# Altium project 4Z_PCB_2.PrjPcb
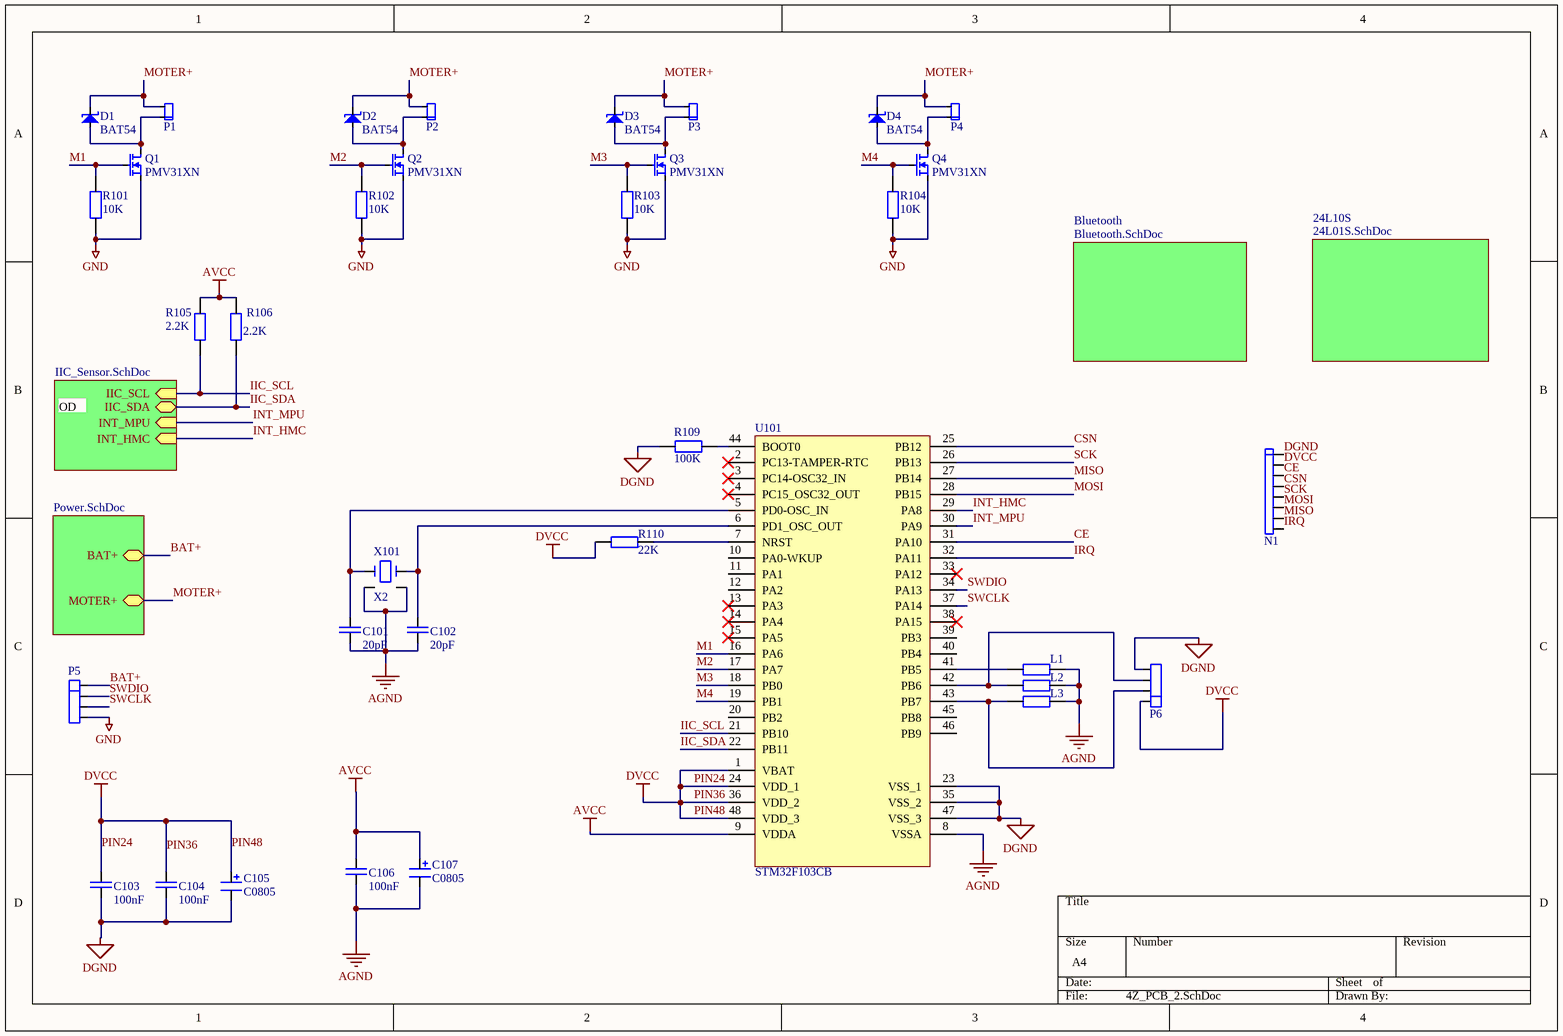
[diagram p0: 4Z_PCB_2.SchDoc]
3 sheets, 54 parts. Net scope: hierarchical (ports join the sheet entries above them; power ports are global).
Board file: 4Z_PCB_2.PcbDoc
Sheets:
  4Z_PCB_2.SchDoc
    IIC_Sensor = IIC_Sensor.SchDoc
  nRF24L01.SchDoc

## Sheet 4Z_PCB_2.SchDoc
size A4

### Parts
C101  20pF  [0603]
C102  20pF  [0603]
C103  100nF  [0603]
C104  100nF  [0603]
C105  C0805  [0805]
C106  100nF  [0603]
C107  C0805  [0805]
D1  BAT54  [BAT54]
D2  BAT54  [BAT54]
D3  BAT54  [BAT54]
D4  BAT54  [BAT54]
L1  (no value)  [0603]
L2  (no value)  [0603]
L3  (no value)  [0603]
N1  DIP_8  (value not drawn)
P1  DIP_2  [DIP_2]  (value not drawn)
P2  DIP_2  [DIP_2]  (value not drawn)
P3  DIP_2  [DIP_2]  (value not drawn)
P4  DIP_2  [DIP_2]  (value not drawn)
P5  DIP_4  [DIP_4]  (value not drawn)
P6  (no value)  [DIP_4]
Q1  PMV31XN  [SOT23-TO236AB]
Q2  PMV31XN  [SOT23-TO236AB]
Q3  PMV31XN  [SOT23-TO236AB]
Q4  PMV31XN  [SOT23-TO236AB]
R101  10K  [0603]
R102  10K  [0603]
R103  10K  [0603]
R104  10K  [0603]
R105  2.2K  [0603]
R106  2.2K  [0603]
R109  100K  [0603]
R110  22K  [0603]
U101  STM32F103CB  [LQFP48]
X101  X2  [3225]

### Sub-sheets
24L10S = 24L01S.SchDoc (file not in this document): no entries
Bluetooth = Bluetooth.SchDoc (file not in this document): no entries
IIC_Sensor = IIC_Sensor.SchDoc: IIC_SCL (in), IIC_SDA (bidir), INT_MPU (in), INT_HMC (in)
Power = Power.SchDoc (file not in this document): BAT+, MOTER+

### Nets
AGND: C101.1 C102.1 C106.1 C107.2 L1.1 L2.1 L3.1 U101.8(VSSA) X101.2 X101.4
AVCC: C106.2 C107.1 R105.1 R106.1 U101.9(VDDA)
DGND: C103.1 C104.1 C105.2 N1.1 P6.4 R109.2 U101.23(VSS_1) U101.35(VSS_2) U101.47(VSS_3)
DVCC: C103.2 C104.2 C105.1 N1.2 P6.1 R110.2 U101.1(VBAT) U101.24(VDD_1) U101.36(VDD_2) U101.48(VDD_3)  [also labelled PIN24, PIN36, PIN48]
GND: P5.4 Q1.2 Q2.2 Q3.2 Q4.2 R101.2 R102.2 R103.2 R104.2
BAT+: P5.1 ; sheet Power/BAT+
CE: N1.3 U101.31(PA10)
CSN: N1.4 U101.25(PB12)
IIC_SCL: R105.2 U101.21(PB10) ; sheet IIC_Sensor/IIC_SCL
IIC_SDA: R106.2 U101.22(PB11) ; sheet IIC_Sensor/IIC_SDA
INT_HMC: U101.29(PA8) ; sheet IIC_Sensor/INT_HMC
INT_MPU: U101.30(PA9) ; sheet IIC_Sensor/INT_MPU
IRQ: N1.8 U101.32(PA11)
M1: Q1.1 R101.1 U101.16(PA6)
M2: Q2.1 R102.1 U101.17(PA7)
M3: Q3.1 R103.1 U101.18(PB0)
M4: Q4.1 R104.1 U101.19(PB1)
MISO: N1.7 U101.27(PB14)
MOSI: N1.6 U101.28(PB15)
MOTER+: D1.3 D2.3 D3.3 D4.3 P1.2 P2.2 P3.2 P4.2 ; sheet Power/MOTER+
SCK: N1.5 U101.26(PB13)
SWCLK: P5.3 U101.37(PA14)
SWDIO: P5.2 U101.34(PA13)
NetC101_2: C101.2 U101.5(PD0-OSC_IN) X101.1
NetC102_2: C102.2 U101.6(PD1_OSC_OUT) X101.3
NetD1_1: D1.1 P1.1 Q1.3
NetD2_1: D2.1 P2.1 Q2.3
NetD3_1: D3.1 P3.1 Q3.3
NetD4_1: D4.1 P4.1 Q4.3
NetL1_2: L1.2 U101.41(PB5)
NetL2_2: L2.2 P6.3 U101.42(PB6)
NetL3_2: L3.2 P6.2 U101.43(PB7)
NetR109_1: R109.1 U101.44(BOOT0)
NetR110_1: R110.1 U101.7(NRST)

Not connected (* = marked no-connect by the designer): U101 2(PC13-TAMPER-RTC)* 3(PC14-OSC32_IN)* 4(PC15_OSC32_OUT)* 10(PA0-WKUP) 11(PA1) 12(PA2) 13(PA3)* 14(PA4)* 15(PA5)* 20(PB2) 33(PA12)* 38(PA15)* 39(PB3) 40(PB4) 45(PB8) 46(PB9)

### Notes on the sheet
- OD

### Library data of the parts
C101-C104 C106 = C0603
L1-L3 R101-R106 R109 R110 = R0603
P6 = DIP_4
X101 = X2: 3225

## Sheet IIC_Sensor.SchDoc
size A4
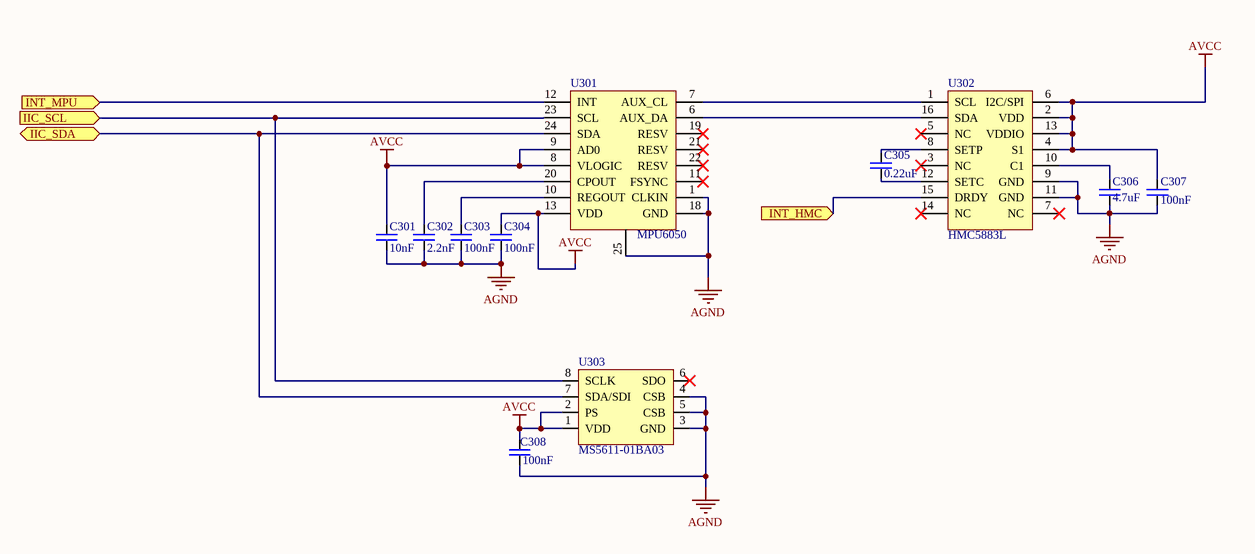
[diagram p1: IIC_Sensor.SchDoc]

### Parts
C301  10nF  [0603]
C302  2.2nF  [0603]
C303  100nF  [0603]
C304  100nF  [0603]
C305  0.22uF  [0603]
C306  4.7uF  [0603]
C307  100nF  [0603]
C308  100nF  [0603]
U301  MPU6050  [MPU6050]
U302  HMC5883L  [HMC5883L]
U303  MS5611-01BA03  [MS5611-01BA03]

### Ports
IIC_SCL (in), IIC_SDA (bidir), INT_HMC (in), INT_MPU (in)

### Nets
AGND: C301.1 C302.1 C303.1 C304.1 C306.1 C307.1 C308.1 U301.1(CLKIN) U301.18(GND) U301.25 U302.9(GND) U302.11(GND) U303.3(GND) U303.4(CSB) U303.5(CSB)
AVCC: C301.2 C304.2 C307.2 C308.2 U301.8(VLOGIC) U301.9(AD0) U301.13(VDD) U302.2(VDD) U302.4(S1) U302.6(I2C/SPI) U302.13(VDDIO) U303.1(VDD) U303.2(PS)
IIC_SCL: U301.23(SCL) U303.8(SCLK) ; port IIC_SCL
IIC_SDA: U301.24(SDA) U303.7(SDA/SDI) ; port IIC_SDA
INT_HMC: U302.15(DRDY) ; port INT_HMC
INT_MPU: U301.12(INT) ; port INT_MPU
NetC302_2: C302.2 U301.20(CPOUT)
NetC303_2: C303.2 U301.10(REGOUT)
NetC305_1: C305.1 U302.12(SETC)
NetC305_2: C305.2 U302.8(SETP)
NetC306_2: C306.2 U302.10(C1)
NetU301_6: U301.6(AUX_DA) U302.16(SDA)
NetU301_7: U301.7(AUX_CL) U302.1(SCL)

Not connected (* = marked no-connect by the designer): U301 11(FSYNC)* 19(RESV)* 21(RESV)* 22(RESV)*; U302 3(NC)* 5(NC)* 7(NC)* 14(NC)*; U303 6(SDO)*

### Library data of the parts
C301-C308 = C0603

## Sheet nRF24L01.SchDoc
size A4
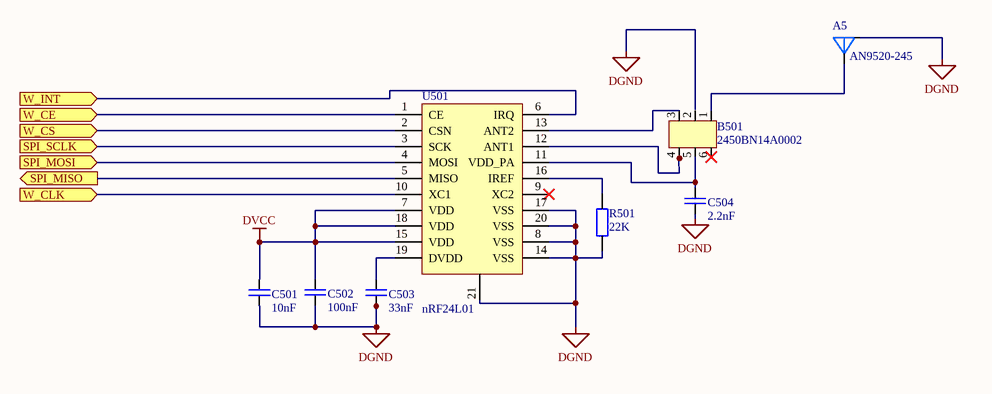
[diagram p2: nRF24L01.SchDoc]

### Parts
A5  AN9520-245  [AN9520-245]
B501  2450BN14A0002  [2450BM14A0002]
C501  10nF  [0603]
C502  100nF  [0603]
C503  33nF  [0603]
C504  2.2nF  [0603]
R501  22K  [0603]
U501  nRF24L01  [nRF24L01]

### Ports
SPI_MISO (out), SPI_MOSI (in), SPI_SCLK (in), W_CE (in), W_CLK (in), W_CS (in), W_INT (in)

### Nets
DGND: A5.2 C501.1 C502.2 C503.1 C504.1 R501.2 U501.8(VSS) U501.14(VSS) U501.17(VSS) U501.20(VSS) U501.21
DVCC: C501.2 C502.1 U501.7(VDD) U501.15(VDD) U501.18(VDD)
NetA5_1: A5.1 B501.1
NetB501_3: B501.3 U501.13(ANT2)
NetB501_4: B501.4 U501.12(ANT1)
NetB501_5: B501.5 C504.2 U501.11(VDD_PA)
NetC503_2: C503.2 U501.19(DVDD)
NetR501_1: R501.1 U501.16(IREF)
NetU501_1: U501.1(CE) ; port W_CE
NetU501_2: U501.2(CSN) ; port W_CS
NetU501_3: U501.3(SCK) ; port SPI_SCLK
NetU501_4: U501.4(MOSI) ; port SPI_MOSI
NetU501_5: U501.5(MISO) ; port SPI_MISO
NetU501_6: U501.6(IRQ) ; port W_INT
NetU501_10: U501.10(XC1) ; port W_CLK

Not connected (* = marked no-connect by the designer): B501 2 6; U501 9(XC2)*

### Library data of the parts
A5 = AN9520-245: antenna
B501 = 2450BN14A0002: nRF24L01
C501-C504 = C0603
R501 = R0603

## Nets that join several sheets
AGND: 4Z_PCB_2 (10 pins), IIC_Sensor (15 pins)
AVCC: 4Z_PCB_2 (5 pins), IIC_Sensor (13 pins)
DGND: 4Z_PCB_2 (9 pins), nRF24L01 (11 pins)
DVCC: 4Z_PCB_2 (10 pins), nRF24L01 (5 pins)
IIC_SCL: 4Z_PCB_2 (R105.2 U101.21), IIC_Sensor (U301.23 U303.8)
IIC_SDA: 4Z_PCB_2 (R106.2 U101.22), IIC_Sensor (U301.24 U303.7)
INT_HMC: 4Z_PCB_2 (U101.29), IIC_Sensor (U302.15)
INT_MPU: 4Z_PCB_2 (U101.30), IIC_Sensor (U301.12)